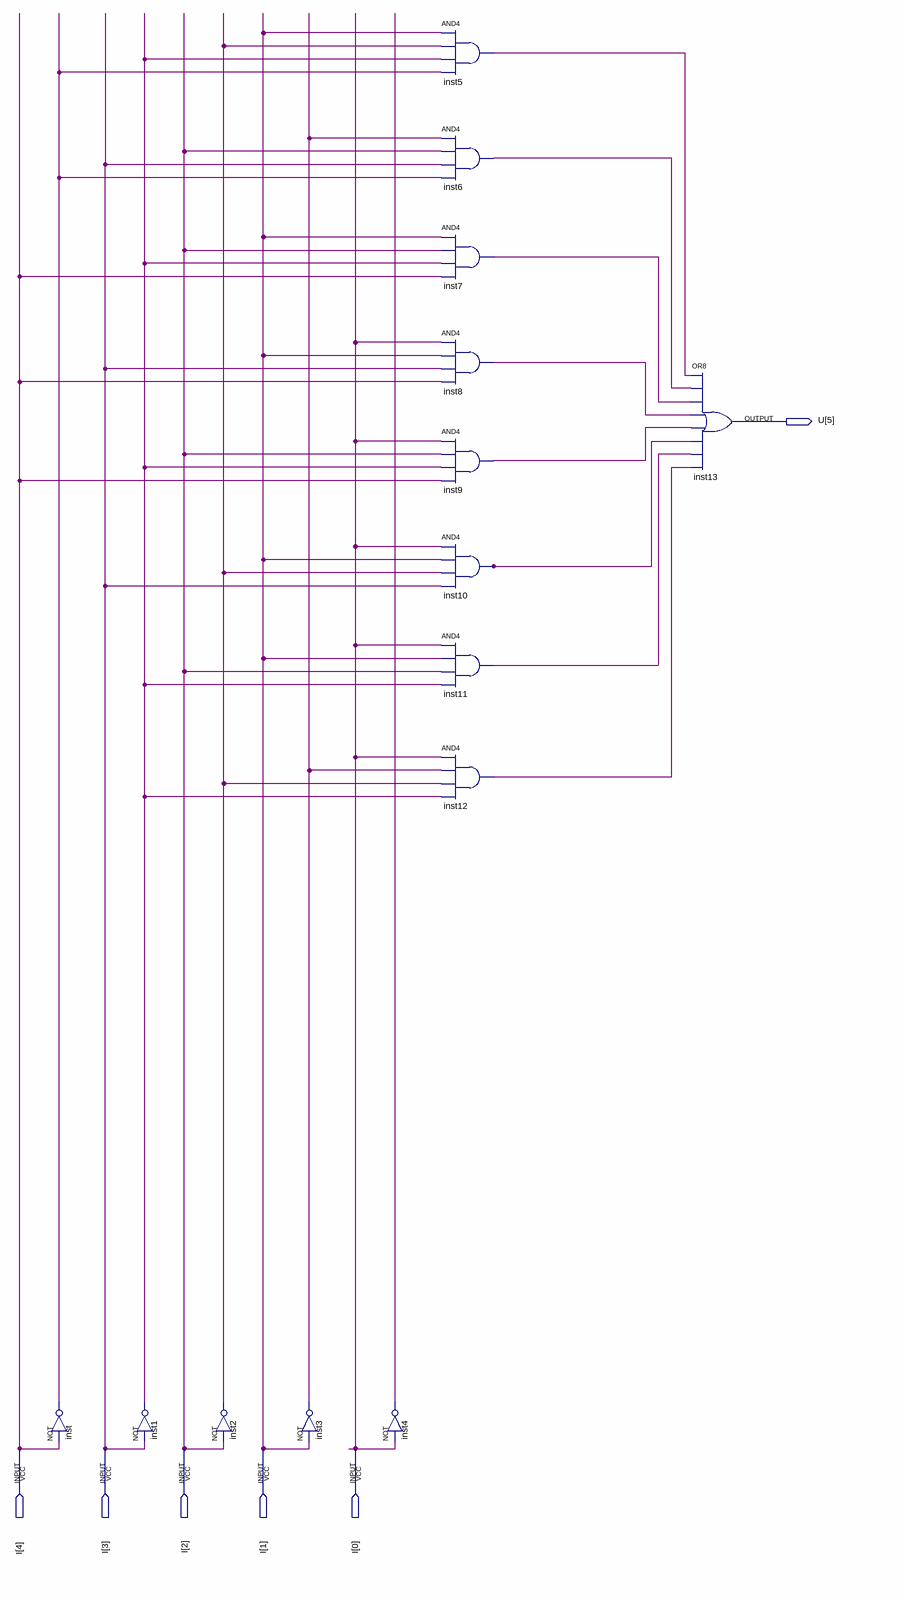
[diagram p0: schematic sheet]
// Quartus schematic BCD_f_Segment.bdf as structural Verilog: 14 symbols, 6 pins
module BCD_f_Segment (
  input  [4:0] I,
  output [5:5] U
);

  wire inst1_out, inst2_out, inst3_out, inst4_out, inst5_out, inst6_out, inst7_out, inst8_out, inst9_out,
       inst10_out, inst11_out, inst12_out, inst_out;

  not inst (inst_out, I[4]);
  not inst1 (inst1_out, I[3]);
  not inst2 (inst2_out, I[2]);
  not inst3 (inst3_out, I[1]);
  not inst4 (inst4_out, I[0]);
  and inst5 (inst5_out, I[1], inst2_out, inst1_out, inst_out);
  and inst6 (inst6_out, inst3_out, I[2], I[3], inst_out);
  and inst7 (inst7_out, I[1], I[2], inst1_out, I[4]);
  and inst8 (inst8_out, I[0], I[1], I[3], I[4]);
  and inst9 (inst9_out, I[0], I[2], inst1_out, I[4]);
  and inst10 (inst10_out, I[0], I[1], inst2_out, I[3]);
  and inst11 (inst11_out, I[0], I[1], I[2], inst1_out);
  and inst12 (inst12_out, I[0], inst3_out, inst2_out, inst1_out);
  or inst13 (U[5], inst5_out, inst6_out, inst7_out, inst8_out, inst9_out, inst10_out, inst11_out, inst12_out);
endmodule
